# Altium schematic sheet EBAZ4205扩展_TPS65185.SchDoc
size A4; DocumentNumber: 4; SheetNumber: 3; SheetTotal: 4
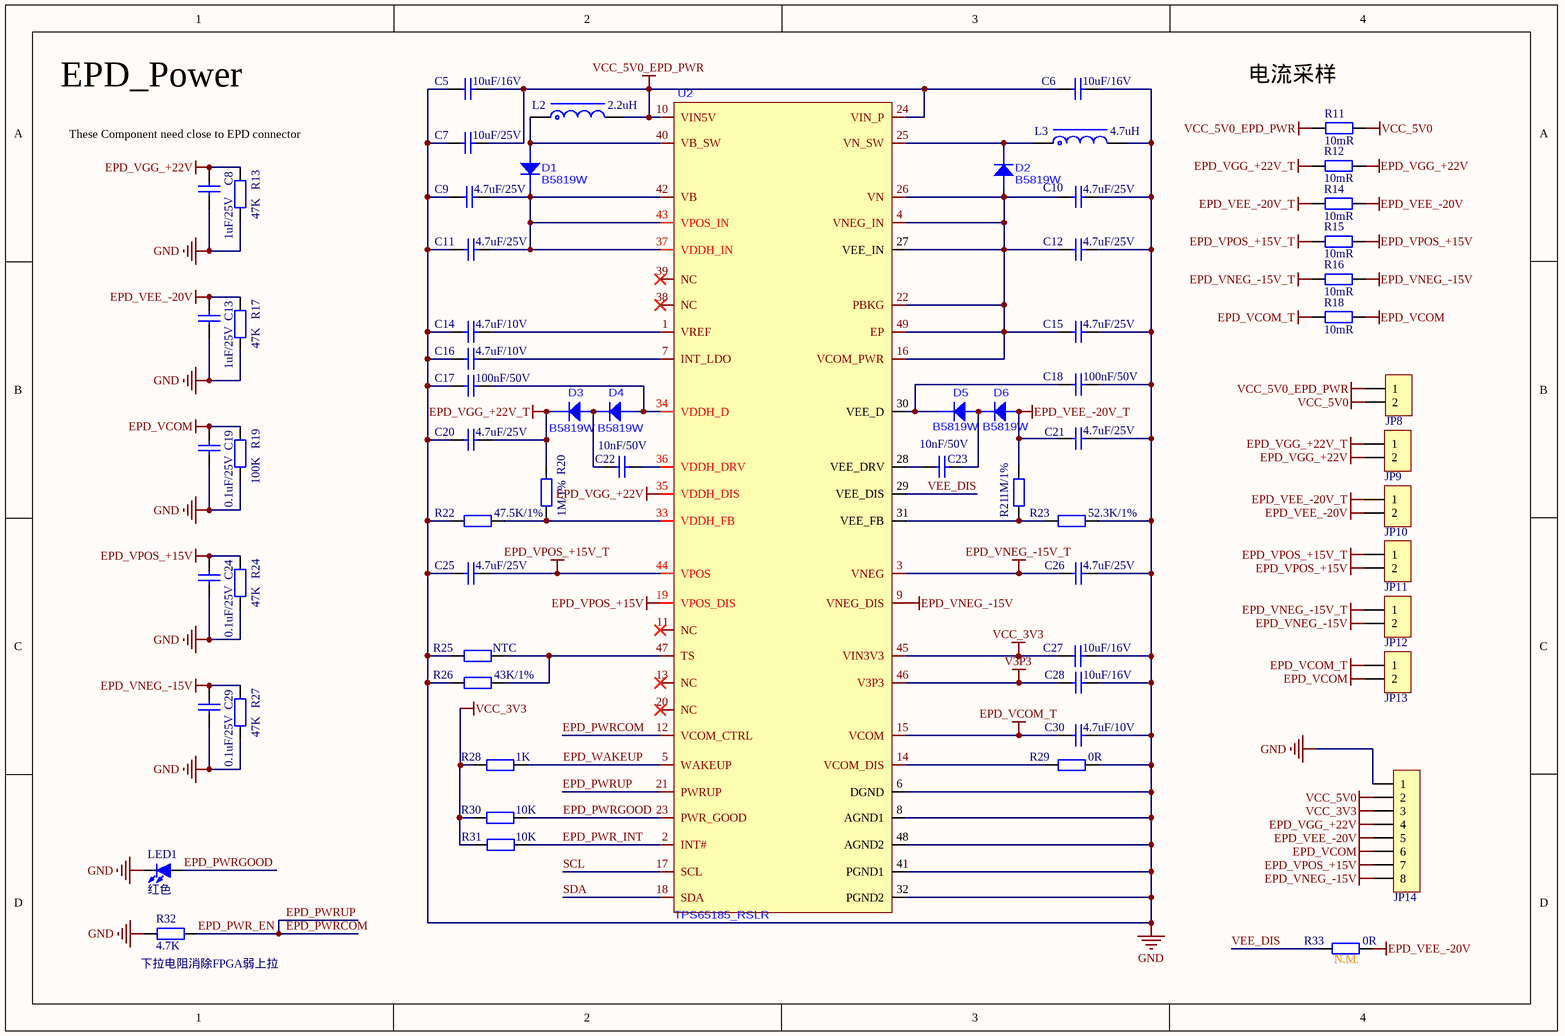
[diagram p0: EBAZ4205扩展_TPS65185.SchDoc]

## Parts
C5  10uF/16V  [C0603_L]
C6  10uF/16V  [C0603_L]
C7  10uF/25V  [C0805_L]
C8  1uF/25V  [C0402_L]
C9  4.7uF/25V  [C1206_L]
C10  4.7uF/25V  [C1206_L]
C11  4.7uF/25V  [C1206_L]
C12  4.7uF/25V  [C1206_L]
C13  1uF/25V  [C0402_L]
C14  4.7uF/10V  [C0603_L]
C15  4.7uF/25V  [C1206_L]
C16  4.7uF/10V  [C0603_L]
C17  100nF/50V  [C0603_L]
C18  100nF/50V  [C0603_L]
C19  0.1uF/25V  [C0402_L]
C20  4.7uF/25V  [C1206_L]
C21  4.7uF/25V  [C1206_L]
C22  10nF/50V  [C0603_L]
C23  10nF/50V  [C0603_L]
C24  0.1uF/25V  [C0402_L]
C25  4.7uF/25V  [C1206_L]
C26  4.7uF/25V  [C1206_L]
C27  10uF/16V  [C0402_L]
C28  10uF/16V  [C0402_L]
C29  0.1uF/25V  [C0402_L]
C30  4.7uF/10V  [C0603_L]
D1  B5819W  [SOD-123]
D2  B5819W  [SOD-123]
D3  B5819W  [SOD-123]
D4  B5819W  [SOD-123]
D5  B5819W  [SOD-123]
D6  B5819W  [SOD-123]
JP8  HDR-1X2  [HDR1.27-LI-2P]  (value not drawn)
JP9  HDR-1X2  [HDR1.27-LI-2P]  (value not drawn)
JP10  HDR-1X2  [HDR1.27-LI-2P]  (value not drawn)
JP11  HDR-1X2  [HDR1.27-LI-2P]  (value not drawn)
JP12  HDR-1X2  [HDR1.27-LI-2P]  (value not drawn)
JP13  HDR-1X2  [HDR1.27-LI-2P]  (value not drawn)
JP14  HDR-1X8  [HDR2.54-LI-8P]  (value not drawn)
L2  2.2uH  [NR6020]
L3  4.7uH  [NR6020]
LED1  红色  [LED0603_B]
R11  10mR  [R0805-HP_L]
R12  10mR  [R0805-HP_L]
R13  47K  [R0402_L]
R14  10mR  [R0805-HP_L]
R15  10mR  [R0805-HP_L]
R16  10mR  [R0805-HP_L]
R17  47K  [R0402_L]
R18  10mR  [R0805-HP_L]
R19  100K  [R0402_L]
R20  1M/1%  [R0402_L]
R21  1M/1%  [R0402_L]
R22  47.5K/1%  [R0402_L]
R23  52.3K/1%  [R0402_L]
R24  47K  [R0402_L]
R25  NTC  [R0402_L]
R26  43K/1%  [R0402_L]
R27  47K  [R0402_L]
R28  1K  [R0402_L]
R29  0R  [R0402_L]
R30  10K  [R0402_L]
R31  10K  [R0402_L]
R32  4.7K  [R0402_L]
R33  0R  [R0402_L]
U2  TPS65185_RSLR  [TPS65185_RSLR]

## Nets
EPD_VCOM: C19.2 JP13.2 JP14.6 R18.2 R19.1
EPD_VCOM_T: C30.1 JP13.1 R18.1 U2.15(VCOM)
EPD_VEE_-20V: C13.2 JP10.2 JP14.5 R14.2 R17.1 R33.2
EPD_VEE_-20V_T: C21.1 D6.1(A) JP10.1 R14.1 R21.1
EPD_VGG_+22V: C8.2 JP9.2 JP14.4 R12.2 R13.1 U2.35(VDDH_DIS)
EPD_VGG_+22V_T: C20.2 D3.2(K) JP9.1 R12.1 R20.1
EPD_VNEG_-15V: C29.2 JP12.2 JP14.8 R16.2 R27.1 U2.9(VNEG_DIS)
EPD_VNEG_-15V_T: C26.1 JP12.1 R16.1 U2.3(VNEG)
EPD_VPOS_+15V: C24.2 JP11.2 JP14.7 R15.2 R24.1 U2.19(VPOS_DIS)
EPD_VPOS_+15V_T: C25.2 JP11.1 R15.1 U2.44(VPOS)
GND: C5.1 C6.2 C7.1 C8.1 C9.1 C10.2 C11.1 C12.2 C13.1 C14.1 C15.2 C16.1 C17.1 C18.2 C19.1 C20.1 C21.2 C24.1 C25.1 C26.2 C27.2 C28.2 C29.1 C30.2 JP14.1 L3.2 LED1.2(K) R13.2 R17.2 R19.2 R22.2 R23.2 R24.2 R25.2 R26.2 R27.2 R29.2 R32.2 U2.6(DGND) U2.8(AGND1) U2.32(PGND2) U2.41(PGND1) U2.48(AGND2)
V3P3: C28.1 U2.46(V3P3)
VCC_3V3: C27.1 JP14.3 R28.2 R30.2 R31.2 U2.45(VIN3V3)
VCC_5V0: JP8.2 JP14.2 R11.2
VCC_5V0_EPD_PWR: C5.2 C6.1 C7.2 JP8.1 L2.2 R11.1 U2.10(VIN5V) U2.24(VIN_P)
EPD_PWR_EN: R32.1 U2.12(VCOM_CTRL) U2.21(PWRUP)  [also labelled EPD_PWRCOM, EPD_PWRUP]
EPD_PWR_INT: R31.1 U2.2(INT#)
EPD_PWRGOOD: LED1.1(A) R30.1 U2.23(PWR_GOOD)
EPD_WAKEUP: R28.1 U2.5(WAKEUP)
SCL: U2.17(SCL)
SDA: U2.18(SDA)
VEE_DIS: R33.1 U2.29(VEE_DIS)
NetC9_2: C9.2 C11.2 D1.2(K) U2.37(VDDH_IN) U2.42(VB) U2.43(VPOS_IN)
NetC10_1: C10.1 C12.1 C15.1 D2.1(A) U2.4(VNEG_IN) U2.16(VCOM_PWR) U2.22(PBKG) U2.26(VN) U2.27(VEE_IN) U2.49(EP)
NetC14_2: C14.2 U2.1(VREF)
NetC16_2: C16.2 U2.7(INT_LDO)
NetC17_2: C17.2 D4.1(A) U2.34(VDDH_D)
NetC18_1: C18.1 D5.2(K) U2.30(VEE_D)
NetC22_1: C22.1 D3.1(A) D4.2(K)
NetC22_2: C22.2 U2.36(VDDH_DRV)
NetC23_1: C23.1 U2.28(VEE_DRV)
NetC23_2: C23.2 D5.1(A) D6.2(K)
NetD1_1: D1.1(A) L2.1 U2.40(VB_SW)
NetD2_2: D2.2(K) L3.1 U2.25(VN_SW)
NetR20_2: R20.2 R22.1 U2.33(VDDH_FB)
NetR21_2: R21.2 R23.1 U2.31(VEE_FB)
NetR25_1: R25.1 R26.1 U2.47(TS)
NetR29_1: R29.1 U2.14(VCOM_DIS)

Not connected (* = marked no-connect by the designer): U2 11(NC)* 13(NC)* 20(NC)* 38(NC)* 39(NC)*

## Notes on the sheet
- EPD_Power
- (near R11) 电流采样
- These Component need close to EPD connector
- (near R32) 下拉电阻消除FPGA弱上拉
- (near R33) N.M.

## Library data of the parts
C5-C30 = C: 贴片电容; 0.0_BOM名称: 无极性贴片电容; 3.交流分享: Q群514746572,开源更新,欢迎一起交流学习PCB设计; 4.作者声明: 旨为整合最全库集,欢迎转载,禁止商用！-冰凌猫; 5.备注说明: 该库已二次整合过网上各热销库,基本最全,无需重复搜购安装; 1.库作者: 冰凌猫; 2.库版本: v2.0 (2021.03.30)
JP8-JP13 = Header 2: 2P接插件; 版权归属: 源创客; BOM名称: 2P接插件; 学习资源: www.ooocke.com
JP14 = Header 8: 8P接插件; 版权归属: 源创客; BOM名称: 8P接插件; 学习资源: www.ooocke.com
L2 L3 = L-NR: 太诱-NR磁胶电感; 0.0_BOM名称: NR磁胶电感; 3.交流分享: Q群514746572,开源更新,欢迎一起交流学习PCB设计; 4.作者声明: 旨为整合最全库集,欢迎转载,禁止商用！-冰凌猫; 5.备注说明: 该库已二次整合过网上各热销库,基本最全,无需重复搜购安装; 1.库作者: 冰凌猫; 2.库版本: v2.0 (2021.03.30)
LED1 = LED-SMD: 贴片LED; 封装库来自淘宝卖家 ID：黄晶宝石: 其他店铺购入均为假冒，请立即申请退款，本店奖励现金5~20元; BOM名称: 贴片LED
R11 R12 R14-R16 R18 = R-High Precision: 贴片精密电阻; BOM名称: 精密电阻; 联系卖家，免费查找封装: 唯一出售店铺网址https://shop463601444.taobao.com; 封装库来自淘宝卖家ID：黄晶宝石: 其他店铺购入均为盗版假冒封装库，请立即申请退款
R13 R17 R19-R33 = R: 贴片电阻; 3.交流分享: Q群514746572,开源更新,欢迎一起交流学习PCB设计; 4.作者声明: 旨为整合最全库集,欢迎转载,禁止商用！-冰凌猫; 5.备注说明: 该库已二次整合过网上各热销库,基本最全,无需重复搜购安装; 1.库作者: 冰凌猫; 2.库版本: v2.0 (2021.03.30); 0.0_BOM名称: 贴片电阻